# EAGLE design pwr-board (EAGLE 5.10)
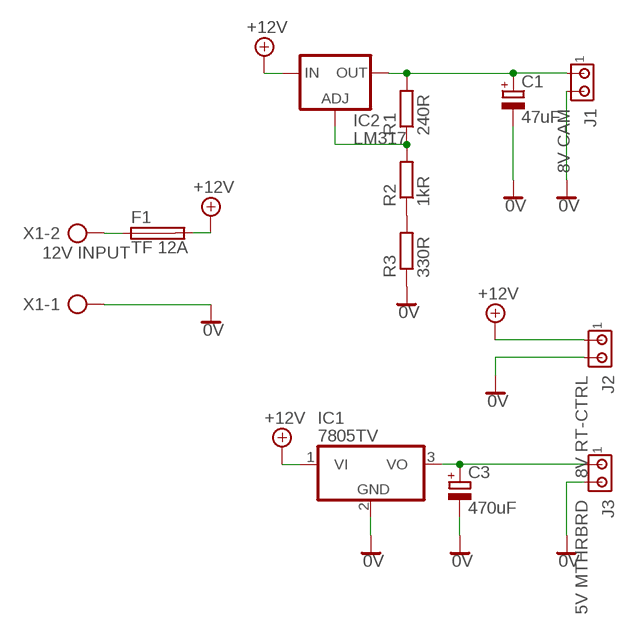
[diagram p0: schematic, sheet 1]

## Parts
C1  47uF  CPOL-EUE5-10.5  [E5-10,5]
C3  470uF  CPOL-EUE5-10.5  [E5-10,5]
F1  TF 12A  SH22,5  [SH22,5]
IC1  7805TV  [TO220V]
IC2  LM317  LM317TS  [317TS]
J1  8V CAM  MTA02-100  [10X02MTA]
J2  8V RT-CTRL  MTA02-100  [10X02MTA]
J3  5V MTHRBRD  MTA02-100  [10X02MTA]
R1  240R  R-EU_0204/5  [0204/5]
R2  1kR  R-EU_0204/5  [0204/5]
R3  330R  R-EU_0204/5  [0204/5]
X1  12V INPUT  AK500/2  [AK500/2]

## Nets
0V: C1.- C3.- IC1.2(GND) J1.2 J2.2 J3.2 R3.1 X1.1
+12V: F1.2 IC1.1(VI) IC2.3(IN) J2.1
N$1: F1.1 X1.2
N$2: C1.+ IC2.2(OUT) J1.1 R1.2
N$3: C3.+ IC1.3(VO) J3.1
N$8: R2.1 R3.2
N$9: IC2.1(ADJ) R1.1 R2.2

## Library data of the parts
C1 C3 = rcl:CPOL-EU: POLARIZED CAPACITOR, European symbol
F1 = fuse:SH22,5: FUSE HOLDER grid 22,5 mm, OGN0031 8201, Schurter (Buerklin)
IC1 = linear:78*: Positive VOLTAGE REGULATOR Source: http://cache.national.com/ds/LM/LM78L05.pdf http://www.fairchildsemi.com/ds/LM/LM7805.pdf
IC2 = v-reg:LM317TS: VOLTAGE REGULATOR
J1-J3 = con-amp:MTA02-100: AMP connector
R1-R3 = rcl:R-EU_: RESISTOR, European symbol
X1 = con-ptr500:AK500/2: CONNECTOR

## Board
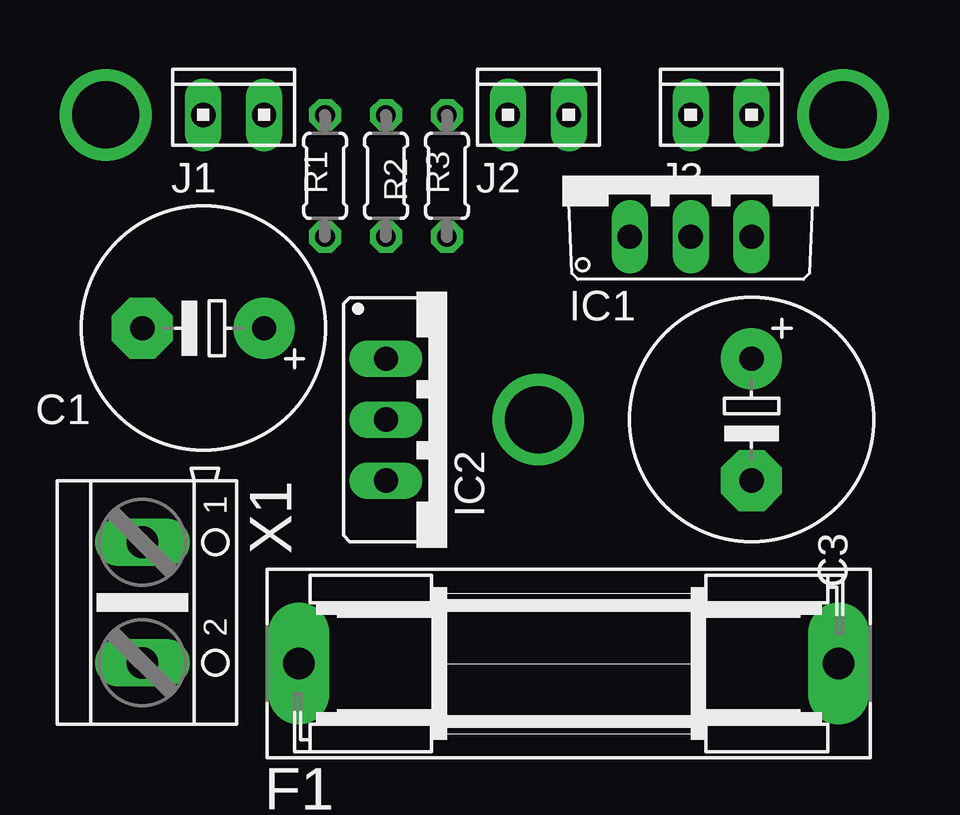
[diagram p1: board, top side]
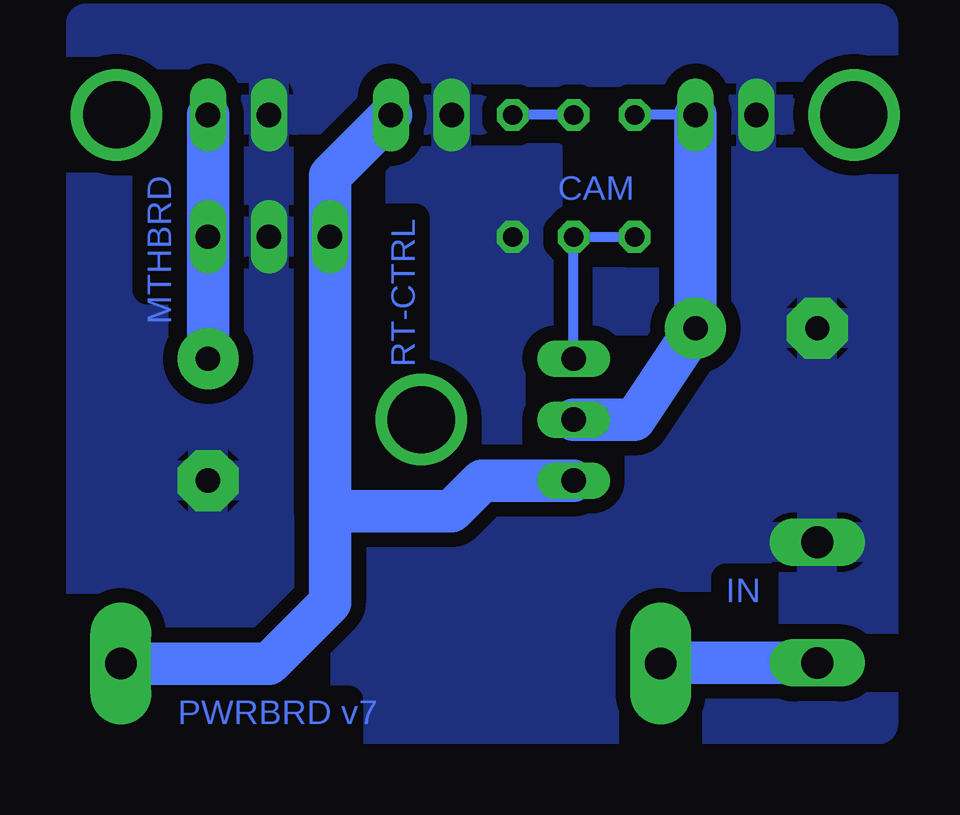
[diagram p2: board, bottom side, seen from below]

No outline drawn. Coordinates in mm, seen from the top.
Copper layers (1*16): Top 0.035mm / dielectric 1.5mm / Bottom 0.035mm
Design rules "default": minimum track width 10mil, minimum drill 24mil, track to track 8mil, track to pad 8mil, pad to pad 8mil, via to via 8mil, smd to smd 8mil, copper to edge 40mil, drill to drill 8mil, minimum pad ring 10mil, minimum via ring 8mil, stop-mask expansion 4mil, vias tented up to drill 0mil, thermal gap 10mil

### Footprints (pad centres in the part's own frame; a part is rotated, then mirrored left to right if it is on the bottom)
E5-10,5 = drill 1.016 pad 2.54 round: + -2.54,0 | drill 1.016 pad 2.54 octagon: - 2.54,0
SH22,5 = drill 1.321 pad 2.54 long: 1 -11.252,0; 2 11.252,0
TO220V = drill 1.016 long: 1 -2.54,-2.54; 2 0,-2.54; 3 2.54,-2.54
317TS = drill 1.016 long: 1 -2.54,-2.54; 2 0,-2.54; 3 2.54,-2.54
10X02MTA = drill 1.016 long: 1 1.27,0; 2 -1.27,0
0204/5 = drill 0.813 octagon: 1 -2.54,0; 2 2.54,0
AK500/2 = drill 1.321 long: 1 -2.515,0; 2 2.515,0

### Placement (x,y rotation side)
C1  12.7,49.53 180 top
C3  35.56,45.72 270 top
F1  27.94,35.56 0 top
IC1  33.02,55.88 0 top
IC2  22.86,45.72 270 top
J1  13.97,58.42 0 top
J2  26.67,58.42 0 top
J3  34.29,58.42 0 top
R1  17.78,55.88 90 top
R2  20.32,55.88 270 top
R3  22.86,55.88 90 top
X1  10.16,38.1 270 top

### Tracks (layer width: path | path; a pad name or v marks a point on that pad's centre or on a via)
0V
  pour Bottom (isolate 0.61): 7.62,62.23 7.62,33.02 40.64,33.02 40.64,62.23
+12V
  Bottom 1.778: 30.48,41.91 30.48,38.1 33.02,35.56 F1.2 | 30.48,41.91 IC1.1 30.48,55.88 J2.1 | 30.48,41.91 25.4,41.91 24.13,43.18 IC2.3
N$1
  Bottom 1.778: X1.2 16.48,35.59 16.51,35.56 F1.1
N$2
  Bottom 0.406: J1.1 R1.2
  Bottom 1.778: J1.1 C1.+ 17.78,45.72 IC2.2
N$3
  Bottom 1.778: C3.+ IC1.3 J3.1
N$4  (via drill 2.8 pad 2.54)
  other vias: 26.67,45.72
N$5  (via drill 2.8 pad 2.54)
  other vias: 8.64,58.42
N$6  (via drill 2.8 pad 2.54)
  other vias: 39.37,58.42
N$8
  Bottom 0.406: R2.1 R3.2
N$9
  Bottom 0.406: IC2.1 R2.2 R1.1

### Text on the board
Bottom: CAM | MTHBRD | RT-CTRL | IN | PWRBRD v7